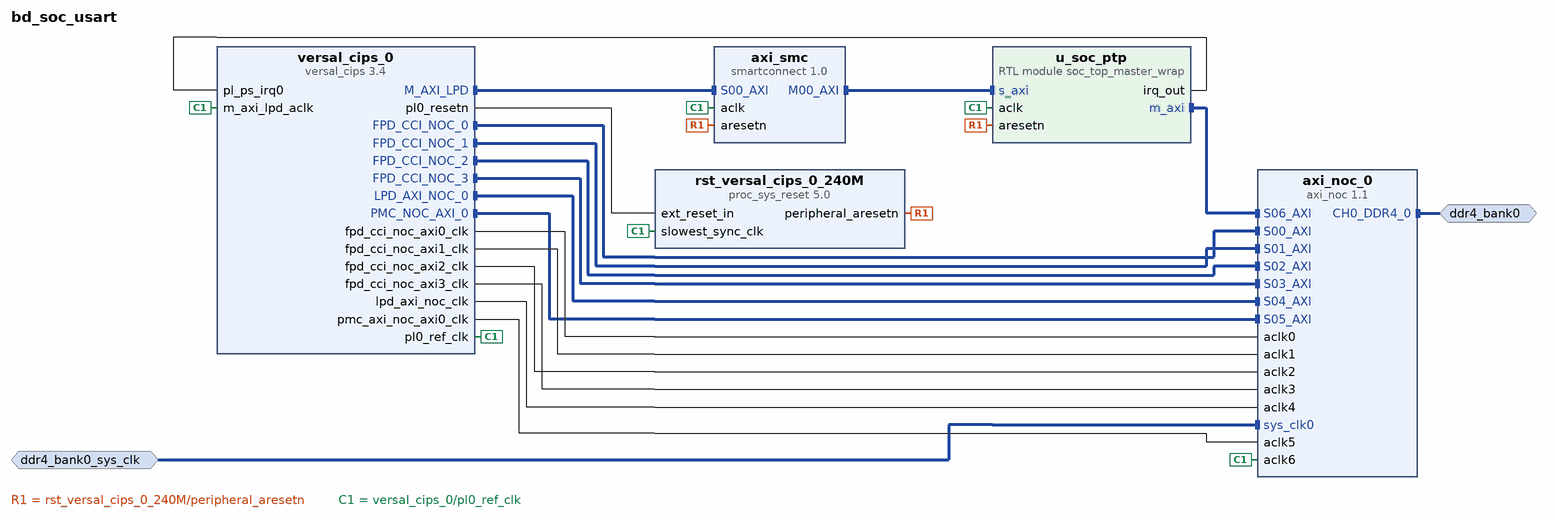
[diagram p0: block diagram of the top level]
# Vivado block design bd_soc_usart, xcve2302-sfva784-1LP-e-S, Vivado 2025.2.1
create_bd_design bd_soc_usart

create_bd_intf_port -mode Master -vlnv xilinx.com:interface:ddr4_rtl:1.0 ddr4_bank0
create_bd_intf_port -mode Slave -vlnv xilinx.com:interface:diff_clock_rtl:1.0 ddr4_bank0_sys_clk
set_property -dict {CONFIG.FREQ_HZ 200000000} [get_bd_intf_ports ddr4_bank0_sys_clk]

create_bd_cell -type ip -vlnv xilinx.com:ip:versal_cips:3.4 versal_cips_0
set_property -dict [list \
  CONFIG.CLOCK_MODE Custom \
  CONFIG.DDR_MEMORY_MODE Custom \
  CONFIG.DEBUG_MODE JTAG \
  CONFIG.DESIGN_MODE 1 \
  CONFIG.PS_BOARD_INTERFACE ps_pmc_fixed_io \
  CONFIG.PS_PL_CONNECTIVITY_MODE Custom \
  CONFIG.PS_PMC_CONFIG {['CLOCK_MODE Custom', 'DDR_MEMORY_MODE {Connectivity to DDR via NOC}', 'DEBUG_MODE JTAG', 'DESIGN_MODE 1', 'PMC_BANK_0_IO_STANDARD LVCMOS1.8', 'PMC_BANK_1_IO_STANDARD LVCMOS1.8', 'PMC_CRP_HSM0_REF_CTRL_FREQMHZ 33.333333', 'PMC_CRP_HSM1_REF_CTRL_FREQMHZ 133.333333', 'PMC_CRP_PL0_REF_CTRL_FREQMHZ 100', 'PMC_I2CPMC_PERIPHERAL {{ENABLE 1} {IO {PMC_MIO 34 .. 35}}}', 'PMC_MIO27 {{AUX_IO 0} {DIRECTION in} {DRIVE_STRENGTH 8mA} {OUTPUT_DATA default} {PULL pullup} {SCHMITT 0} {SLEW slow} {USAGE GPIO}}', 'PMC_MIO37 {{AUX_IO 0} {DIRECTION in} {DRIVE_STRENGTH 8mA} {OUTPUT_DATA default} {PULL pullup} {SCHMITT 0} {SLEW slow} {USAGE GPIO}}', 'PMC_MIO51 {{AUX_IO 0} {DIRECTION out} {DRIVE_STRENGTH 8mA} {OUTPUT_DATA default} {PULL pullup} {SCHMITT 0} {SLEW slow} {USAGE GPIO}}', 'PMC_OSPI_PERIPHERAL {{ENABLE 1} {IO {PMC_MIO 0 .. 11}} {MODE Single}}', 'PMC_QSPI_FBCLK {{ENABLE 1} {IO {PMC_MIO 6}}}', 'PMC_QSPI_PERIPHERAL_DATA_MODE x1', 'PMC_QSPI_PERIPHERAL_ENABLE 0', 'PMC_QSPI_PERIPHERAL_MODE Single', 'PMC_REF_CLK_FREQMHZ 33.333333', 'PMC_SD0 {{CD_ENABLE 0} {CD_IO {PMC_MIO 24}} {POW_ENABLE 0} {POW_IO {PMC_MIO 17}} {RESET_ENABLE 1} {RESET_IO {PMC_MIO 49}} {WP_ENABLE 0} {WP_IO {PMC_MIO 25}}}', 'PMC_SD0_DATA_TRANSFER_MODE 8Bit', 'PMC_SD0_PERIPHERAL {{CLK_100_SDR_OTAP_DLY 0x00} {CLK_200_SDR_OTAP_DLY 0x2} {CLK_50_DDR_ITAP_DLY 0x1E} {CLK_50_DDR_OTAP_DLY 0x5} {CLK_50_SDR_ITAP_DLY 0x2C} {CLK_50_SDR_OTAP_DLY 0x5} {ENABLE 1} {IO {PMC_MIO 37 .. 49}}}', 'PMC_SD0_SLOT_TYPE eMMC', 'PMC_SD1 {{CD_ENABLE 1} {CD_IO {PMC_MIO 28}} {POW_ENABLE 0} {POW_IO {PMC_MIO 12}} {RESET_ENABLE 0} {RESET_IO {PMC_MIO 12}} {WP_ENABLE 0} {WP_IO {PMC_MIO 1}}}', 'PMC_SD1_DATA_TRANSFER_MODE 4Bit', 'PMC_SD1_PERIPHERAL {{CLK_100_SDR_OTAP_DLY 0x00} {CLK_200_SDR_OTAP_DLY 0x00} {CLK_50_DDR_ITAP_DLY 0x00} {CLK_50_DDR_OTAP_DLY 0x00} {CLK_50_SDR_ITAP_DLY 0x2C} {CLK_50_SDR_OTAP_DLY 0x4} {ENABLE 1} {IO {PMC_MIO 26 .. 36}}}', 'PMC_SD1_SLOT_TYPE {SD 2.0}', 'PMC_USE_PMC_NOC_AXI0 1', 'PS_BANK_2_IO_STANDARD LVCMOS1.8', 'PS_BANK_3_IO_STANDARD LVCMOS3.3', 'PS_BOARD_INTERFACE ps_pmc_fixed_io', 'PS_ENET0_MDIO {{ENABLE 1} {IO {PS_MIO 24 .. 25}}}', 'PS_ENET0_PERIPHERAL {{ENABLE 1} {IO {PS_MIO 0 .. 11}}}', 'PS_GEN_IPI0_ENABLE 1', 'PS_GEN_IPI1_ENABLE 1', 'PS_GEN_IPI2_ENABLE 1', 'PS_GEN_IPI3_ENABLE 1', 'PS_GEN_IPI4_ENABLE 1', 'PS_GEN_IPI5_ENABLE 1', 'PS_GEN_IPI6_ENABLE 1', 'PS_HSDP_EGRESS_TRAFFIC JTAG', 'PS_HSDP_INGRESS_TRAFFIC JTAG', 'PS_HSDP_MODE NONE', 'PS_I2C1_PERIPHERAL {{ENABLE 1} {IO {PS_MIO 16 .. 17}}}', 'PS_I2CSYSMON_PERIPHERAL {{ENABLE 1} {IO {PS_MIO 18 .. 19}}}', 'PS_IRQ_USAGE {{CH0 1} {CH1 1} {CH10 0} {CH11 0} {CH12 0} {CH13 0} {CH14 0} {CH15 0} {CH2 0} {CH3 0} {CH4 0} {CH5 0} {CH6 0} {CH7 0} {CH8 0} {CH9 0}}', 'PS_MIO22 {{AUX_IO 0} {DIRECTION in} {DRIVE_STRENGTH 8mA} {OUTPUT_DATA default} {PULL pullup} {SCHMITT 0} {SLEW slow} {USAGE GPIO}}', 'PS_MIO23 {{AUX_IO 0} {DIRECTION out} {DRIVE_STRENGTH 8mA} {OUTPUT_DATA default} {PULL pullup} {SCHMITT 0} {SLEW slow} {USAGE GPIO}}', 'PS_NUM_FABRIC_RESETS 1', 'PS_PL_CONNECTIVITY_MODE Custom', 'PS_UART1_PERIPHERAL {{ENABLE 1} {IO {PS_MIO 12 .. 13}}}', 'PS_USB3_PERIPHERAL {{ENABLE 1} {IO {PMC_MIO 13 .. 25}}}', 'PS_USE_FPD_CCI_NOC 1', 'PS_USE_FPD_CCI_NOC0 1', 'PS_USE_M_AXI_LPD 1', 'PS_USE_NOC_LPD_AXI0 1', 'PS_USE_PMCPL_CLK0 1', 'PS_USE_S_AXI_LPD 0', 'SMON_ALARMS Set_Alarms_On', 'SMON_ENABLE_TEMP_AVERAGING 0', 'SMON_INTERFACE_TO_USE I2C', 'SMON_TEMP_AVERAGING_SAMPLES 0', 'SMON_VAUX_CH0 {{ALARM_ENABLE 0} {ALARM_LOWER 0} {ALARM_UPPER 1} {AVERAGE_EN 0} {ENABLE 1} {IO_N LPD_MIO21_502} {IO_P LPD_MIO20_502} {MODE {1 V unipolar}} {NAME VAUX_CH0} {SUPPLY_NUM 0}}', 'SMON_VAUX_CH1 {{ALARM_ENABLE 0} {ALARM_LOWER 0} {ALARM_UPPER 1} {AVERAGE_EN 0} {ENABLE 1} {IO_N LPD_MIO15_502} {IO_P LPD_MIO14_502} {MODE {1 V unipolar}} {NAME VAUX_CH1} {SUPPLY_NUM 1}}']} \
] [get_bd_cells versal_cips_0]
create_bd_cell -type ip -vlnv xilinx.com:ip:axi_noc:1.1 axi_noc_0
set_property -dict [list \
  CONFIG.CH0_DDR4_0_BOARD_INTERFACE ddr4_bank0 \
  CONFIG.MC_CHAN_REGION1 DDR_LOW1 \
  CONFIG.MC_SYSTEM_CLOCK Differential \
  CONFIG.NUM_CLKS 7 \
  CONFIG.NUM_MC 1 \
  CONFIG.NUM_MCP 4 \
  CONFIG.NUM_MI 0 \
  CONFIG.NUM_SI 7 \
  CONFIG.sys_clk0_BOARD_INTERFACE ddr4_bank0_sys_clk \
] [get_bd_cells axi_noc_0]
create_bd_cell -type ip -vlnv xilinx.com:ip:smartconnect:1.0 axi_smc
set_property -dict {CONFIG.NUM_SI 1} [get_bd_cells axi_smc]
create_bd_cell -type ip -vlnv xilinx.com:ip:proc_sys_reset:5.0 rst_versal_cips_0_240M
create_bd_cell -type module -reference soc_top_master_wrap u_soc_ptp

# ---- connections ----

connect_bd_intf_net [get_bd_intf_ports ddr4_bank0] [get_bd_intf_pins axi_noc_0/CH0_DDR4_0]
connect_bd_intf_net [get_bd_intf_pins axi_smc/M00_AXI] [get_bd_intf_pins u_soc_ptp/s_axi]
connect_bd_intf_net [get_bd_intf_ports ddr4_bank0_sys_clk] [get_bd_intf_pins axi_noc_0/sys_clk0]
connect_bd_intf_net -intf_net u_soc_m_axi [get_bd_intf_pins u_soc_ptp/m_axi] [get_bd_intf_pins axi_noc_0/S06_AXI]
connect_bd_intf_net [get_bd_intf_pins versal_cips_0/FPD_CCI_NOC_0] [get_bd_intf_pins axi_noc_0/S00_AXI]
connect_bd_intf_net [get_bd_intf_pins versal_cips_0/FPD_CCI_NOC_1] [get_bd_intf_pins axi_noc_0/S01_AXI]
connect_bd_intf_net [get_bd_intf_pins versal_cips_0/FPD_CCI_NOC_2] [get_bd_intf_pins axi_noc_0/S02_AXI]
connect_bd_intf_net [get_bd_intf_pins versal_cips_0/FPD_CCI_NOC_3] [get_bd_intf_pins axi_noc_0/S03_AXI]
connect_bd_intf_net [get_bd_intf_pins versal_cips_0/LPD_AXI_NOC_0] [get_bd_intf_pins axi_noc_0/S04_AXI]
connect_bd_intf_net [get_bd_intf_pins versal_cips_0/M_AXI_LPD] [get_bd_intf_pins axi_smc/S00_AXI]
connect_bd_intf_net [get_bd_intf_pins versal_cips_0/PMC_NOC_AXI_0] [get_bd_intf_pins axi_noc_0/S05_AXI]
connect_bd_net [get_bd_pins rst_versal_cips_0_240M/peripheral_aresetn] [get_bd_pins axi_smc/aresetn] [get_bd_pins u_soc_ptp/aresetn]
connect_bd_net -net u_soc_irq_out [get_bd_pins u_soc_ptp/irq_out] [get_bd_pins versal_cips_0/pl_ps_irq0]
connect_bd_net [get_bd_pins versal_cips_0/fpd_cci_noc_axi0_clk] [get_bd_pins axi_noc_0/aclk0]
connect_bd_net [get_bd_pins versal_cips_0/fpd_cci_noc_axi1_clk] [get_bd_pins axi_noc_0/aclk1]
connect_bd_net [get_bd_pins versal_cips_0/fpd_cci_noc_axi2_clk] [get_bd_pins axi_noc_0/aclk2]
connect_bd_net [get_bd_pins versal_cips_0/fpd_cci_noc_axi3_clk] [get_bd_pins axi_noc_0/aclk3]
connect_bd_net [get_bd_pins versal_cips_0/lpd_axi_noc_clk] [get_bd_pins axi_noc_0/aclk4]
connect_bd_net [get_bd_pins versal_cips_0/pl0_ref_clk] \
  [get_bd_pins versal_cips_0/m_axi_lpd_aclk] [get_bd_pins axi_smc/aclk] [get_bd_pins rst_versal_cips_0_240M/slowest_sync_clk] \
  [get_bd_pins axi_noc_0/aclk6] [get_bd_pins u_soc_ptp/aclk]
connect_bd_net [get_bd_pins versal_cips_0/pl0_resetn] [get_bd_pins rst_versal_cips_0_240M/ext_reset_in]
connect_bd_net [get_bd_pins versal_cips_0/pmc_axi_noc_axi0_clk] [get_bd_pins axi_noc_0/aclk5]

# ---- address map ----
assign_bd_address -offset 0x0000000000 -range 2G -target_address_space [get_bd_addr_spaces u_soc_ptp/m_axi] [get_bd_addr_segs axi_noc_0/S06_AXI/C0_DDR_LOW0]
assign_bd_address -offset 0x0000000000000000 -range 2G -target_address_space [get_bd_addr_spaces versal_cips_0/FPD_CCI_NOC_0] [get_bd_addr_segs axi_noc_0/S00_AXI/C3_DDR_LOW0]
assign_bd_address -offset 0x0000000800000000 -range 6G -target_address_space [get_bd_addr_spaces versal_cips_0/FPD_CCI_NOC_0] [get_bd_addr_segs axi_noc_0/S00_AXI/C3_DDR_LOW1]
assign_bd_address -offset 0x0000000000000000 -range 2G -target_address_space [get_bd_addr_spaces versal_cips_0/FPD_CCI_NOC_1] [get_bd_addr_segs axi_noc_0/S01_AXI/C2_DDR_LOW0]
assign_bd_address -offset 0x0000000800000000 -range 6G -target_address_space [get_bd_addr_spaces versal_cips_0/FPD_CCI_NOC_1] [get_bd_addr_segs axi_noc_0/S01_AXI/C2_DDR_LOW1]
assign_bd_address -offset 0x0000000000000000 -range 2G -target_address_space [get_bd_addr_spaces versal_cips_0/FPD_CCI_NOC_2] [get_bd_addr_segs axi_noc_0/S02_AXI/C0_DDR_LOW0]
assign_bd_address -offset 0x0000000800000000 -range 6G -target_address_space [get_bd_addr_spaces versal_cips_0/FPD_CCI_NOC_2] [get_bd_addr_segs axi_noc_0/S02_AXI/C0_DDR_LOW1]
assign_bd_address -offset 0x0000000000000000 -range 2G -target_address_space [get_bd_addr_spaces versal_cips_0/FPD_CCI_NOC_3] [get_bd_addr_segs axi_noc_0/S03_AXI/C1_DDR_LOW0]
assign_bd_address -offset 0x0000000800000000 -range 6G -target_address_space [get_bd_addr_spaces versal_cips_0/FPD_CCI_NOC_3] [get_bd_addr_segs axi_noc_0/S03_AXI/C1_DDR_LOW1]
assign_bd_address -offset 0x0000000000000000 -range 2G -target_address_space [get_bd_addr_spaces versal_cips_0/LPD_AXI_NOC_0] [get_bd_addr_segs axi_noc_0/S04_AXI/C3_DDR_LOW0]
assign_bd_address -offset 0x0000000800000000 -range 6G -target_address_space [get_bd_addr_spaces versal_cips_0/LPD_AXI_NOC_0] [get_bd_addr_segs axi_noc_0/S04_AXI/C3_DDR_LOW1]
assign_bd_address -offset 0x00080000000 -range 64K -target_address_space [get_bd_addr_spaces versal_cips_0/M_AXI_LPD] [get_bd_addr_segs u_soc_ptp/s_axi/reg0]
assign_bd_address -offset 0x0000000000000000 -range 2G -target_address_space [get_bd_addr_spaces versal_cips_0/PMC_NOC_AXI_0] [get_bd_addr_segs axi_noc_0/S05_AXI/C2_DDR_LOW0]
assign_bd_address -offset 0x0000000800000000 -range 6G -target_address_space [get_bd_addr_spaces versal_cips_0/PMC_NOC_AXI_0] [get_bd_addr_segs axi_noc_0/S05_AXI/C2_DDR_LOW1]

validate_bd_design
save_bd_design
